# EAGLE design Adafruit CH9102F (EAGLE 9.6.2)
COMPANY: ADAFRUIT INDUSTRIES; DRAWN: KTOWN; REV: A
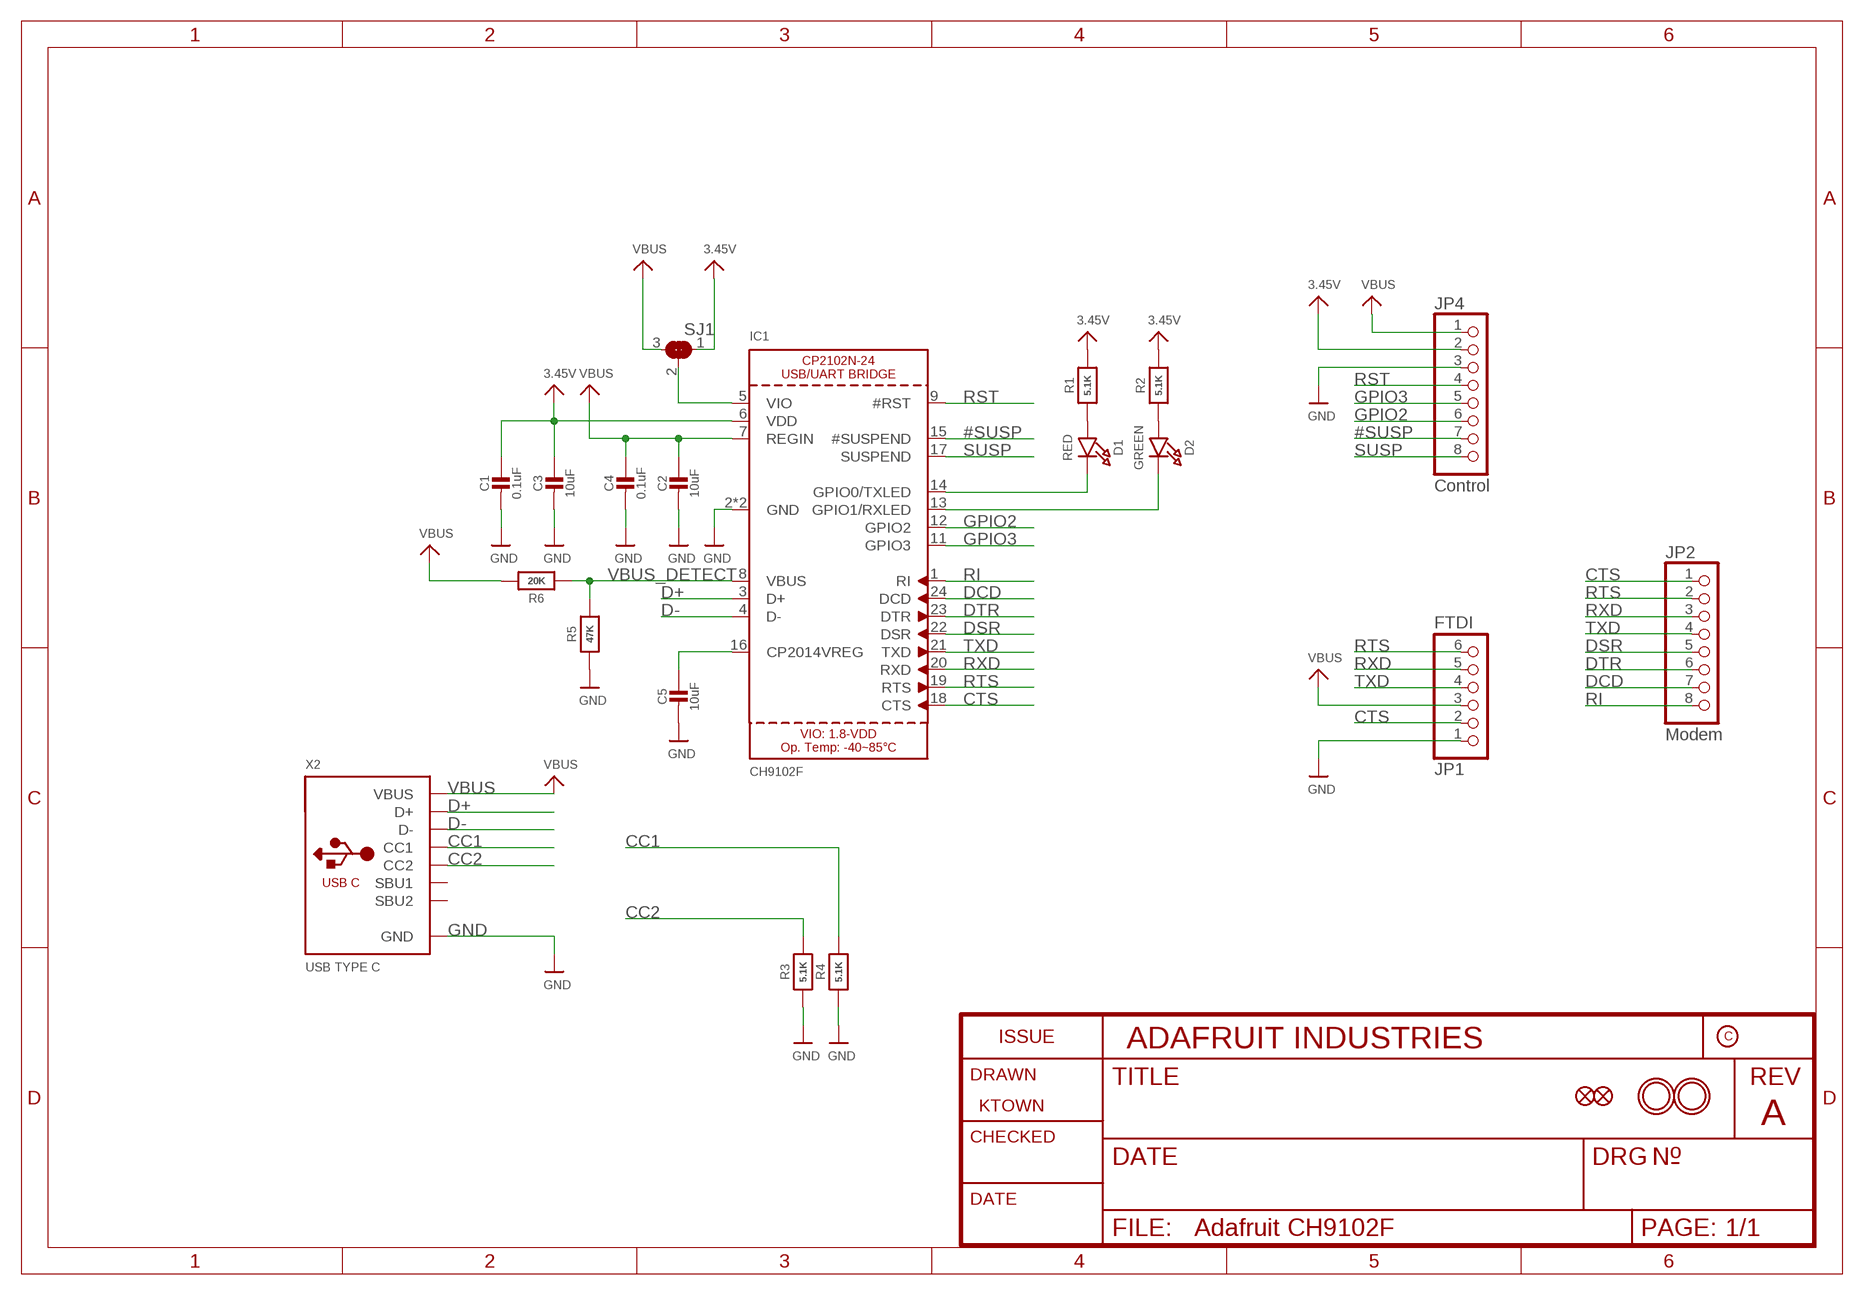
[diagram p0: schematic, sheet 1]

## Parts
C1  0.1uF  CAP_CERAMIC0603_NO  [0603-NO]
C2  10uF  CAP_CERAMIC0805-NOOUTLINE  [0805-NO]
C3  10uF  CAP_CERAMIC0805-NOOUTLINE  [0805-NO]
C4  0.1uF  CAP_CERAMIC0603_NO  [0603-NO]
C5  10uF  CAP_CERAMIC0805-NOOUTLINE  [0805-NO]
D1  RED  LED0603_NOOUTLINE  [CHIPLED_0603_NOOUTLINE]
D2  GREEN  LED0603_NOOUTLINE  [CHIPLED_0603_NOOUTLINE]
FID1  FIDUCIAL_1MM  [FIDUCIAL_1MM]
FID2  FIDUCIAL_1MM  [FIDUCIAL_1MM]
IC1  CH9102F  CP2102N-24  [QFN24_4MM_SMSC]
JP1  FTDI  HEADER-1X676MIL  [1X06_ROUND_76]
JP2  Modem  HEADER-1X870MIL  [1X08_ROUND_70]
JP4  Control  HEADER-1X870MIL  [1X08_ROUND_70]
R1  5.1K  RESISTOR_0603_NOOUT  [0603-NO]
R2  5.1K  RESISTOR_0603_NOOUT  [0603-NO]
R3  5.1K  RESISTOR_0603_NOOUT  [0603-NO]
R4  5.1K  RESISTOR_0603_NOOUT  [0603-NO]
R5  47K  RESISTOR_0603_NOOUT  [0603-NO]
R6  20K  RESISTOR_0603_NOOUT  [0603-NO]
SJ1  SOLDERJUMPER_2WAY  [SOLDERJUMPER_2WAY_OPEN_NOPASTE]
U$18  MOUNTINGHOLE2.5  [MOUNTINGHOLE_2.5_PLATED]
U$19  MOUNTINGHOLE2.5  [MOUNTINGHOLE_2.5_PLATED]
X2  USB TYPE C  USB_C  [USB_C_CUSB31-CFM2AX-01-X]

## Nets
3.3V: C1.1 C3.1 IC1.6(VDD) JP4.2 R1.2 R2.2 SJ1.1 ; supply symbol labelled 3.45V
#SUSP: IC1.15(#SUSPEND) JP4.7
CC1: R4.2 X2.A5(CC1)
CC2: R3.2 X2.B5(CC2)
CTS: IC1.18(CTS) JP1.2 JP2.1
D+: IC1.3(D+) X2.A6(D+) X2.B6(D+)
D-: IC1.4(D-) X2.A7(D-) X2.B7(D-)
DCD: IC1.24(DCD) JP2.7
DSR: IC1.22(DSR) JP2.5
DTR: IC1.23(DTR) JP2.6
GND: C1.2 C2.2 C3.2 C4.2 C5.2 IC1.2(GND) IC1.THERM(GND) JP1.1 JP4.3 R3.1 R4.1 R5.1 X2.A1B12(GND) X2.B1A12(GND)
GPIO2: IC1.12(GPIO2) JP4.6
GPIO3: IC1.11(GPIO3) JP4.5
N$1: D1.A R1.1
N$2: C5.1 IC1.16(CP2014VREG)
N$3: IC1.5(VIO) SJ1.2
N$5: D2.A R2.1
N$6: D1.C IC1.14(GPIO0/TXLED)
N$7: D2.C IC1.13(GPIO1/RXLED)
RI: IC1.1(RI) JP2.8
RST: IC1.9(#RST) JP4.4
RTS: IC1.19(RTS) JP1.6 JP2.2
RXD: IC1.20(RXD) JP1.5 JP2.3
SUSP: IC1.17(SUSPEND) JP4.8
TXD: IC1.21(TXD) JP1.4 JP2.4
VBUS: C2.1 C4.1 IC1.7(REGIN) JP1.3 JP4.1 R6.2 SJ1.3 X2.A4B9(VBUS) X2.B4A9(VBUS)
VBUS_DETECT: IC1.8(VBUS) R5.2 R6.1
Unconnected: X2.A8(SBU1) X2.B8(SBU2)

## Library data of the parts
C1-C5 = microbuilder:CAP_CERAMIC: Ceramic Capacitors For new designs, use the packages preceded by an '_' character since they are more reliable: The following footprints should be used on most boards: _0402 - Standard footprint for regular board layouts _0603 - Standard footprint for regular board layouts _0805 - Standard footprint for regular board layouts _1206 - Standard footprint for regular board layouts For extremely tight-pitch boards where space is at a premium, the following 'micro-pitch' footprints can be used (smaller pads, no silkscreen outline, etc.): _0402MP - Micro-pitch footprint for very dense/compact boards _0603MP - Micro-pitch footprint for very dense/compact boards _0805MP - Micro-pitch footprint for very dense/compact boards _1206MP - Micro-pitch footprint for very dense/compact boards
D1 D2 = microbuilder:LED: LED 0603 - 0603 Surface Mount Package 2mA: Green LED - Low Power (3.9mcd, 2ma, 1.7Vf) - Digikey: 475-2709-2-ND Orange LED - Low Power (9.8mcd, 2ma, 1.8Vf) - Digikey: 475-1194-2-ND Red LED - Low Power (5mcd, 2ma, 1.8Vf) - Digikey: 475-1195-2-ND Yellow LED - Low Power (7mcd, 2ma, 1.8Vf) - Digikey: 475-1196-2-ND 5mA: Blue LED - Low Power (17mcd, 5ma, 2.9Vf) - Digikey: LNJ937W8CRACT-ND 0805 - 0805 Surface Mount Package 2mA: Red LED (8.8mcd, 2mA, 1.8Vf, Clear) - Low Power [Digikey: 475-2510-1-ND] Green LED (5mcd, 2mA, 1.8Vf, Clear) - Low Power [Digikey: 475-2730-1-ND] Yellow LED (11.3mcd, 2mA, 1.8Vf, Clear) - Low Power [Digikey: 475-2555-1-ND] 20mA: Red LED (104mcd, 20mA, Diffused) - LS R976 [Digikey: 475-1278-6-ND] Red LED (12mcd, 20mA, 2.0Vf, Clear) - APT2012EC [Digikey: 754-1128-1-ND] Green LED (15mcd, 20mA, 2.2Vf, Clear) - APT2012GC [Digikey: 754-1131-1-ND] Orange LED (160mcd, 20mA, 2.1Vf, Clear) - APT2012SECK [Digikey: 754-1130-1-ND] 1206 - 1206 Surface Mount Package Green LED (26mcd, 20mA, Diffused) - LG N971 [Digikey: 475-1407-6-ND] Red LED (15mcd, 20mA, Diffused) - LH N974 [Digikey: 475-1416-6-ND] Cree - Cree High-Power Surface Mount LEDs XPEBWT-L1-0000-00D50 - White 111lm 350mA 2.9Vf 6200K 110° XTEAWT-00-0000-00000LEE3 - White 114lm 350mA 2.85Vf 5000K 115° Everlight - Everlight 45-21 Series Surface Mount LEDs 45-21/QK2C-B2832AC2CB2/2T - Warm White 2000mcd 20mA 3.25Vf 3050K 120° 45-21/LK2C-B38452C4CB2/2T - Nuetral White 2000mcd 20mA 3.25Vf 4150K 120° 45-21/LK2C-B50634C6CB2/2T - Cold White 2200mcd 20mA 3.25Vf 5650K 120° PLCC2 Reverse Mount LS T77K-J1L2-1-0-2-R18-Z - Red 11.25mcd 2mA 1.8Vf 630nm 120° LO T77K-L1M2-24-Z - Orange 19.6mcd 2mA 1.8Vf 606nm 120° LY T77K-K2M1-26-Z - Yellow 15.7mcd 2mA 1.8Vf 587nm 120°; JLC_ROTATION: 270
FID1 FID2 = microbuilder:FIDUCIAL: Fiducial Alignment Points Various fiducial points for machine vision alignment.; BOM: EXCLUDE
IC1 = microbuilder:CP2102N-24; JLC_ROTATION: 270
JP1 = microbuilder:HEADER-1X6: PIN HEADER
JP2 JP4 = microbuilder:HEADER-1X8: PIN HEADER
R1-R6 = microbuilder:RESISTOR: Resistors For new designs, use the packages preceded by an '_' character since they are more reliable: The following footprints should be used on most boards: _0402 - Standard footprint for regular board layouts _0603 - Standard footprint for regular board layouts _0805 - Standard footprint for regular board layouts _1206 - Standard footprint for regular board layouts For extremely tight-pitch boards where space is at a premium, the following 'micro-pitch' footprints can be used (smaller pads, no silkscreen outline, etc.): _0402MP - Micro-pitch footprint for very dense/compact boards _0603MP - Micro-pitch footprint for very dense/compact boards _0805MP - Micro-pitch footprint for very dense/compact boards _1206MP - Micro-pitch footprint for very dense/compact boards
SJ1 = microbuilder:SOLDERJUMPER_2WAY: 2-Way Solder Jumper
U$18 U$19 = adafruit_electromech:MOUNTINGHOLE: Mounting Hole For #2 screws (0.086"/2.18mm width, 0.094"/2.4mm hole) use 2.5mm; BOM: EXCLUDE
X2 = adafruit_electromech:USB_C: USB Type-C USB 2.0 Connector; LCSC: C165948

## Board
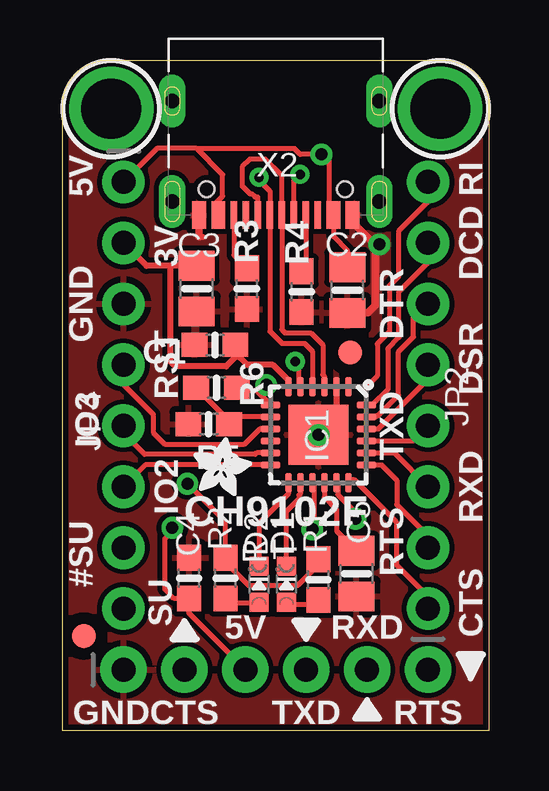
[diagram p1: board, top side]
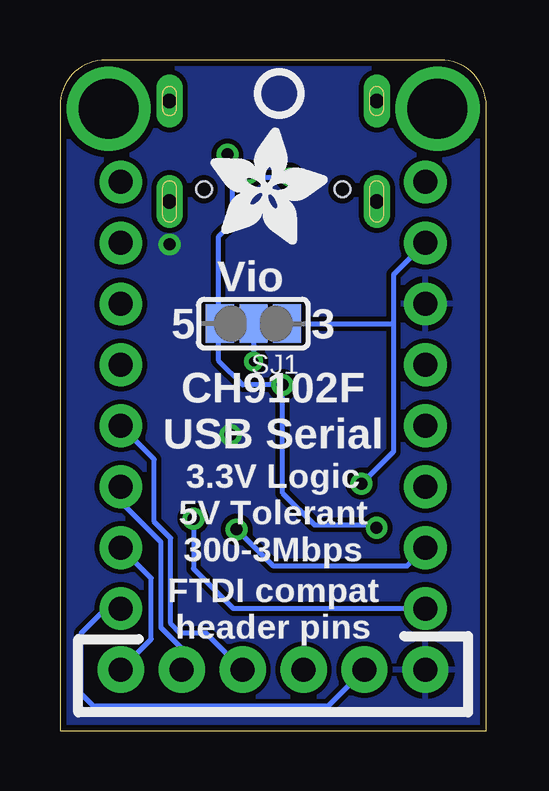
[diagram p2: board, bottom side, seen from below]

Size 17.78 x 27.94 mm. Coordinates in mm from the lower left corner, seen from the top.
Outline: 0,0 0,26.04 arc-90 1.91,27.94 15.88,27.94 arc-90 17.78,26.04 17.78,0 0,0
Copper layers (1*16): Top 0.035mm / dielectric 1.5mm / Bottom 0.035mm
Design rules "adafruit *": minimum track width 8mil, minimum drill 15.5mil, track to track 8mil, track to pad 8mil, pad to pad 8mil, via to via 8mil, smd to smd 8mil, copper to edge 10mil, drill to drill 8mil, minimum pad ring 10mil, minimum via ring 8mil, stop-mask expansion 2mil, vias tented up to drill 20mil, thermal gap 10mil

### Footprints (pad centres in the part's own frame; a part is rotated, then mirrored left to right if it is on the bottom)
0603-NO = smd 1.075 x 1: 1 -0.85,0; 2 0.85,0
0805-NO = smd 1.24 x 1.5: 1 -0.95,0; 2 0.95,0
CHIPLED_0603_NOOUTLINE = smd 0.8 x 0.8: A 0,-0.75; C 0,0.75
FIDUCIAL_1MM = smd 1 x 1: 1 0,0
QFN24_4MM_SMSC = smd 0.8 x 0.28: 1 -2,1.25; 2 -2,0.75; 3 -2,0.25; 4 -2,-0.25; 5 -2,-0.75; 6 -2,-1.25; 13 2,-1.25; 14 2,-0.75; 15 2,-0.25; 16 2,0.25; 17 2,0.75; 18 2,1.25 | smd 0.28 x 0.8: 7 -1.25,-2; 8 -0.75,-2; 9 -0.25,-2; 10 0.25,-2; 11 0.75,-2; 12 1.25,-2; 19 1.25,2; 20 0.75,2; 21 0.25,2; 22 -0.25,2; 23 -0.75,2; 24 -1.25,2 | smd 2.5 x 2.5: THERM 0,0
1X06_ROUND_76 = drill 1 pad 1.93: 1 -6.35,0; 2 -3.81,0; 3 -1.27,0; 4 1.27,0; 5 3.81,0; 6 6.35,0
1X08_ROUND_70 = drill 1 pad 1.778: 1 -8.89,0; 2 -6.35,0; 3 -3.81,0; 4 -1.27,0; 5 1.27,0; 6 3.81,0; 7 6.35,0; 8 8.89,0
SOLDERJUMPER_2WAY_OPEN_NOPASTE = smd 1.168 x 1.6: 1 -1.397,0; 2 0,0; 3 1.397,0
MOUNTINGHOLE_2.5_PLATED = drill 2.5 pad 3.2: P$1 0,0
USB_C_CUSB31-CFM2AX-01-X = smd 0.575 x 1.15: A1B12 -3.2,2.275; A4B9 -2.4,2.275; B1A12 3.2,2.275; B4A9 2.4,2.275 | smd 0.275 x 1.15: A5 -1.25,2.275; A6 -0.25,2.275; A7 0.25,2.275; A8 1.25,2.275; B5 1.75,2.275; B6 0.75,2.275; B7 -0.75,2.275; B8 -1.75,2.275 | drill 0.6 pad 1 long: M1 -4.32,1.7; M2 4.32,1.7; M3 -4.32,-2.48; M4 4.32,-2.48 | hole 0.65: 2.89,1.2; -2.89,1.2

### Placement (x,y rotation side)
C1  6.35,16.07 180 top
C2  11.87,18.35 270 top
C3  5.59,18.41 270 top
C4  5.27,6.35 90 top
C5  12.26,6.54 270 top
D1  9.33,6.1 0 top
D2  8.19,6.1 0 top
FID1  0.89,3.94 0 top
FID2  12,15.75 0 top
IC1  10.67,12.32 270 top
JP1  8.89,2.54 0 top
JP2  15.24,13.97 90 top
JP4  2.54,13.97 270 top
R1  10.67,6.29 90 top
R2  6.79,6.35 90 top
R3  7.68,18.41 90 top
R4  9.97,18.29 90 top
R5  6.1,12.76 0 top
R6  6.41,14.29 0 top
SJ1  9.72,16.95 180 bottom
U$8  [ADAFRUIT_2.5MM]  5.46,9.78 0 top
U$17  [PCBFEAT-REV-040]  8.64,26.54 0 bottom
U$18  15.75,25.91 0 top
U$19  2.03,25.91 0 top
U$22  [ADAFRUIT_5MM]  11.49,20.26 0 bottom
X2  8.89,23.75 180 top

### Tracks (layer width: path | path; a pad name or v marks a point on that pad's centre or on a via)
3.3V  (via drill 0.5)
  Top 0.203: R1.2 10.67,6.91 9.81,6.05 7.75,6.05 6.79,7 R2.2 6.79,8.7 v5.21,10.29
  Top 0.254: IC1.6 9.42,14.59 8.77,15.24 7.71,15.24 7.2,15.75 C1.1 7.2,15.56 6.82,15.18 4.7,15.18 4.51,15.37 4.51,19.36 | C3.1 4.51,19.36 | 4.51,19.36 3.5,19.36 JP4.2
  Bottom 0.203: 3.87,17.02 3.87,18.99 JP4.2 | 3.87,17.02 3.87,11.62 v5.21,10.29 | SJ1.1 3.94,16.95 3.87,17.02
#SUSP  (via drill 0.5)
  Top 0.203: IC1.15 10.47,10.26 10.47,8.44 v10.41,8.38
  Bottom 0.203: v10.41,8.38 8.89,6.86 3.3,6.86 JP4.7
CC1
  Top 0.203: X2.A5 10.14,19.31 R4.2
CC2
  Top 0.203: X2.B5 7.14,19.81 R3.2
CTS
  Top 0.203: IC1.18 12.04,10.45 12.17,10.45 13.92,8.7 13.92,6.91 15.24,5.59 JP2.1
  Bottom 0.203: JP1.2 6.6,1.02 16.38,1.02 16.89,1.52 16.89,4.06 15.88,5.08 JP2.1
D+
  Top 0.203: X2.B6 8.14,22.24 8.02,22.24 7.9,22.35 7.83,22.35 7.49,22.7 7.49,23.49 7.81,23.81 8.45,23.81 9.14,23.12 X2.A6 9.14,16.7 9.27,16.57 10.35,16.57 10.85,16.07 10.85,14.83 10.92,14.76 IC1.3
D-  (via drill 0.39)
  Top 0.203: X2.B7 9.64,22.91 v9.91,23.18 | v8.19,23.05 8.19,22.92 8.62,22.49 8.64,22.49 X2.A7 8.64,16.63 9.14,16.13 10.1,16.13 10.42,15.81 IC1.4
  Bottom 0.203: v9.91,23.18 9.78,23.05 v8.19,23.05
DCD
  Top 0.203: IC1.24 12.92,13.57 13.56,14.2 13.56,15.9 14.03,16.38 14.03,18.29 15.24,19.49 JP2.7
DSR
  Top 0.203: IC1.22 13.17,12.57 15.24,14.64 JP2.5
DTR
  Top 0.203: IC1.23 13.05,13.07 13.1,13.12 13.15,13.12 14.01,13.98 14.01,15.78 14.63,16.4 14.63,17.59 14.82,17.78 JP2.6
GND  (via drill 0.5)
  Top 0.254: 5.69,20.57 5.85,20.57 | IC1.2 11.42,13.07 IC1.THERM
  Top 0.305: X2.A1B12 12.09,21.18 13.04,20.23 13.04,17.72 12.73,17.4 C2.2 | X2.B1A12 5.69,20.57
  other vias: 10.67,12.32 13.21,20.26
  pour Top: 17.78,27.81 0,27.81 0,0 17.78,0
  pour Bottom: 17.78,27.94 0,27.81 0,0 17.78,0
GPIO2
  Top 0.203: IC1.12 3.45,11.07 JP4.6
GPIO3
  Top 0.203: IC1.11 8.1,11.57 8.03,11.51 3.42,11.51 2.54,12.38 JP4.5
N$1
  Top 0.203: R1.1 10.48,5.25 9.43,5.25 D1.A
N$2
  Top 0.203: C5.1 11.43,8.32 11.43,9.21 10.92,9.72 IC1.16
N$3  (via drill 0.39)
  Top 0.203: IC1.5 9.86,14.37 9.86,15.31 9.79,15.38 v9.7,15.38
  Bottom 0.203: SJ1.2 9.7,16.94 v9.7,15.38
N$4
  Bottom 0.203: 9.34,16.89 8.76,16.89
N$5
  Top 0.203: D2.A 8.15,5.31 6.99,5.31 R2.1
N$6
  Top 0.203: IC1.14 9.92,9.87 9.85,9.81 9.85,9.65 9.34,9.13 D1.C
N$7
  Top 0.203: IC1.13 9.42,9.86 8.19,8.64 D2.C
RI
  Top 0.203: JP2.8 15.24,22.04 14.01,20.8 14.01,18.92 13.63,18.54 13.63,16.61 13.12,16.11 13.12,14.76 12.68,14.32 IC1.1
RST
  Top 0.203: IC1.9 8.22,12.57 7.59,11.93 4.26,11.93 3.78,12.41 3.78,13.18 2.54,14.41 JP4.4
RTS
  Top 0.203: IC1.19 13.3,11.07 13.94,10.43 13.94,9.42 15.24,8.12 JP2.2
  Bottom 0.203: JP1.6 13.97,3.81 13.97,6.35 JP2.2
RXD
  Top 0.203: IC1.20 13.83,11.57 JP2.3
  Bottom 0.203: JP1.5 12.7,3.43 13.56,4.29 13.56,7.85 15.24,9.53 JP2.3
SUSP  (via drill 0.5)
  Top 0.203: IC1.17 11.47,10.26 11.47,9.83 12.21,9.1 v12.21,8.83
  Bottom 0.203: v12.21,8.83 12.21,6.75 10.54,5.08 JP4.8
TXD
  Top 0.203: IC1.21 14.61,12.07 JP2.4
  Bottom 0.203: JP1.4 11.68,4.06 12.76,4.06 13.16,4.46 13.16,8.02 13.84,8.7 13.84,11.3 JP2.4
VBUS  (via drill 0.5)
  Top 0.203: C2.1 11.87,20 11.29,20.59 X2.A4B9 11.1,21.66 11.1,23.76 10.86,24 v10.79,24 9.91,24 9.65,24.26 5.59,24.26 | X2.B4A9 6.4,21.57 6.4,21.98 6.68,22.27 6.68,23.16 5.59,24.26 | 5.59,24.26 3.94,24.26 JP4.1 | JP1.3 5.27,4.89 C4.1 4.66,5.5 4.25,5.91 4.25,8 4.57,8.32 v4.57,8.45 | R6.2 7.38,14.17 8.07,14.17 8.26,14.17 v8.5,14.4 8.17,14.07 IC1.7
  Bottom 0.203: 11.18,16.95 11.18,20.57 10.6,21.14 10.6,22.99 10.79,23.18 v10.79,24 | 11.18,16.95 11.18,15.43 10.15,14.4 v8.5,14.4 8.5,9.89 7.18,8.57 4.7,8.57 v4.57,8.45 | SJ1.3 11.18,16.95
VBUS_DETECT
  Top 0.203: R6.1 6.95,12.9 R5.2 7.25,13.07 IC1.8

### Text on the board
tPlace: 5V | RI | 3V | DCD | GND | DTR | RST | DSR | IO3 | TXD | IO2 | RXD | CH9102F | R | T | RTS | #SU | SU | CTS | 5V | RXD | GND | CTS | TXD | RTS
bPlace: Vio | 3 | 5 | CH9102F / USB Serial | 3.3V Logic / 5V Tolerant / 300-3Mbps | FTDI compat / header pins